# Altium project H-Watch.PrjPcb (part 1 of 2)
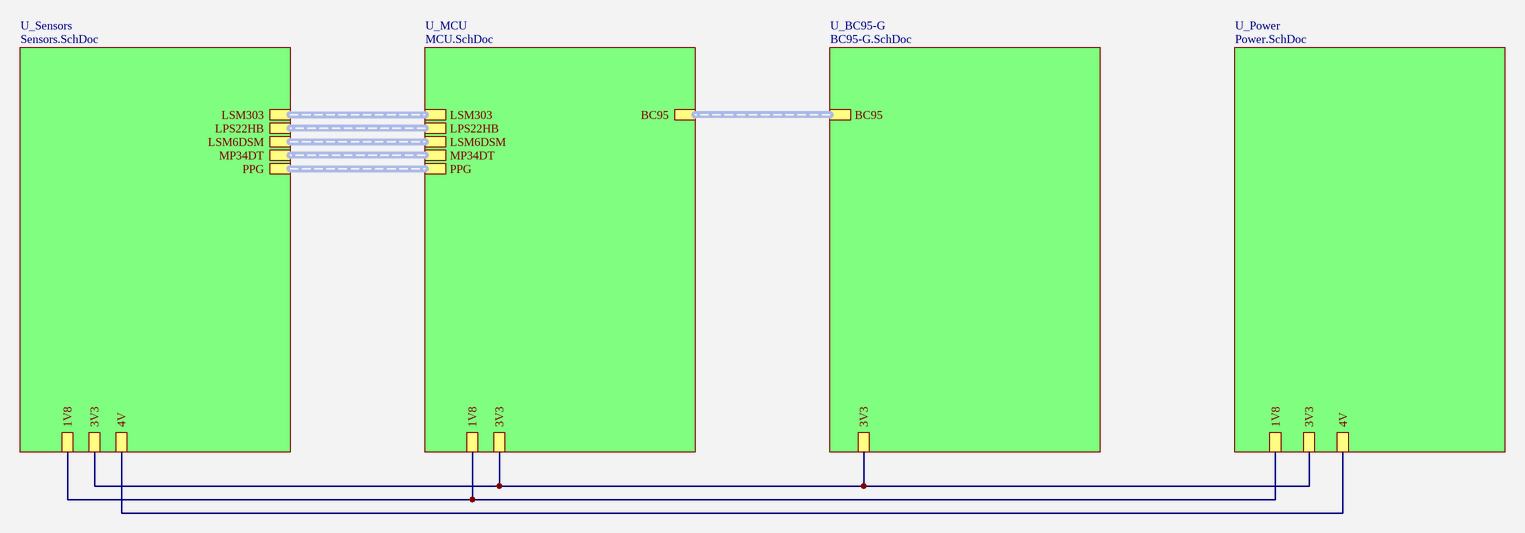
[diagram p0: H-Watch.SchDoc]
5 sheets, 122 parts. Net scope: hierarchical (ports join the sheet entries above them; power ports are global).
Board file: H-Watch.PcbDoc
Sheets:
  H-Watch.SchDoc
    U_Sensors = Sensors.SchDoc
    U_Power = Power.SchDoc
    U_MCU = MCU.SchDoc
    U_BC95-G = BC95-G.SchDoc

## Sheet H-Watch.SchDoc: H-Watch Main
size A3; DrawnBy: schuluka; Organization: ETH-PBL; DocumentNumber: SCH1V0.2; Revision: V0.2; SheetNumber: 1; SheetTotal: 5

### Sub-sheets
U_BC95-G = BC95-G.SchDoc: BC95 (harness H8), 3V3
U_MCU = MCU.SchDoc: 1V8, 3V3, LSM303 (harness *), LPS22HB (harness *), LSM6DSM (harness *), MP34DT (harness *), PPG (harness *), BC95 (harness H8)
U_Power = Power.SchDoc: 1V8, 3V3, 4V
U_Sensors = Sensors.SchDoc: PPG (harness *), MP34DT (harness *), LSM6DSM (harness *), LPS22HB (harness *), LSM303 (harness *), 1V8, 4V, 3V3

### Nets
1V8: sheet U_Sensors/1V8, sheet U_Power/1V8, sheet U_MCU/1V8
3V3: sheet U_Sensors/3V3, sheet U_Power/3V3, sheet U_MCU/3V3, sheet U_BC95-G/3V3
4V: sheet U_Sensors/4V, sheet U_Power/4V

### Buses and harness runs
harness sheet U_BC95-G/BC95 = sheet U_MCU/BC95
harness sheet U_MCU/LPS22HB = sheet U_Sensors/LPS22HB
harness sheet U_MCU/LSM6DSM = sheet U_Sensors/LSM6DSM
harness sheet U_MCU/LSM303 = sheet U_Sensors/LSM303
harness sheet U_MCU/MP34DT = sheet U_Sensors/MP34DT
harness sheet U_MCU/PPG = sheet U_Sensors/PPG

### Notes on the sheet
- 1
- 2
- 3
- 4
- 5
- 6
- 7
- 8
- A
- B
- C
- D
- Project:
- Date:
- Drawing number:
- Rev:
- Format:
- A3
- Drawn by:
- Laboratory:
- Page
- Sheet:
- of
- File:

## Sheet Sensors.SchDoc: H-Watch Sensors
size A3; DrawnBy: schuluka; Organization: ETH-PBL; DocumentNumber: SCH2V0.2; Revision: V0.2; SheetNumber: 2; SheetTotal: 5
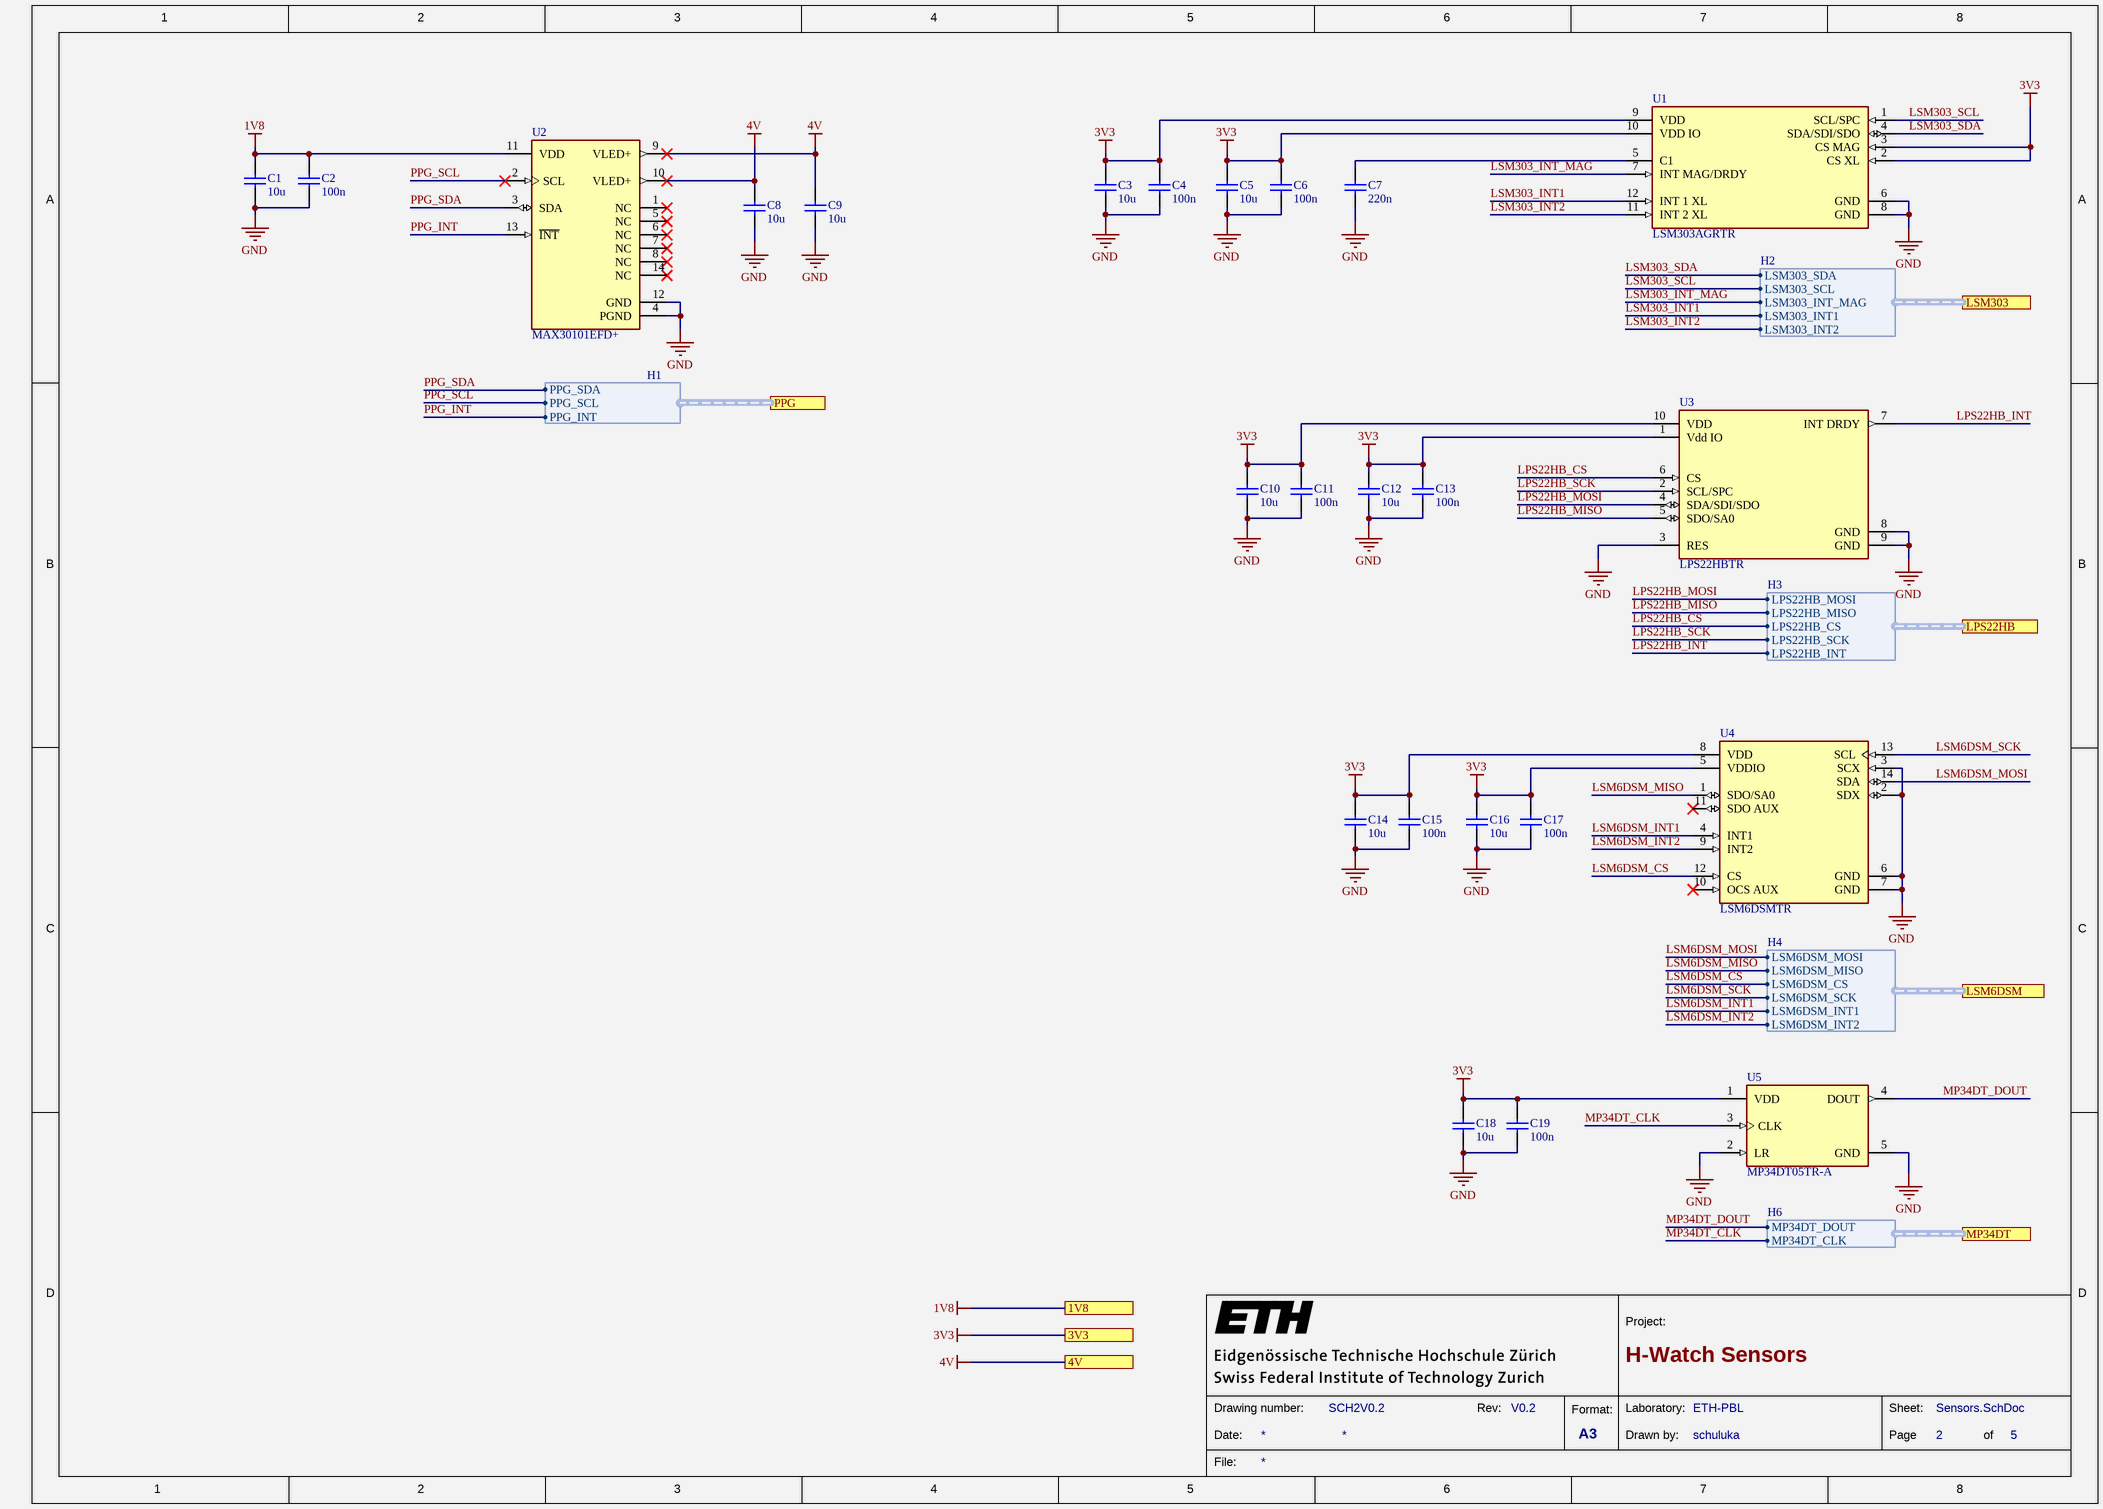
[diagram p1: Sensors.SchDoc]

### Parts
C1  10u  [CAPC1005X70X10NL05]
C2  100n  [CAPC1005X60X30ML05T10]
C3  10u  [CAPC1005X70X10NL05]
C4  100n  [CAPC1005X60X30ML05T10]
C5  10u  [CAPC1005X70X10NL05]
C6  100n  [CAPC1005X60X30ML05T10]
C7  220n  [CAPC1005X55X25ML05T10]
C8  10u  [CAPC1005X70X10NL05]
C9  10u  [CAPC1005X70X10NL05]
C10  10u  [CAPC1005X70X10NL05]
C11  100n  [CAPC1005X60X30ML05T10]
C12  10u  [CAPC1005X70X10NL05]
C13  100n  [CAPC1005X60X30ML05T10]
C14  10u  [CAPC1005X70X10NL05]
C15  100n  [CAPC1005X60X30ML05T10]
C16  10u  [CAPC1005X70X10NL05]
C17  100n  [CAPC1005X60X30ML05T10]
C18  10u  [CAPC1005X70X10NL05]
C19  100n  [CAPC1005X60X30ML05T10]
U1  LSM303AGRTR  [FP-LGA-12-8487206-MFG]
U2  MAX30101EFD+  [FP-F143A5-1-MFG]
U3  LPS22HBTR  [FP-HLGA-10L-8479831-0]
U4  LSM6DSMTR  [FP-LGA-14L-DM00249496-MFG]
U5  MP34DT05TR-A  [FP-HCLGA-DM00231908-MFG]

### Ports
1V8, 3V3, 4V, LPS22HB (harness H3), LSM6DSM (harness H4), LSM303 (harness H2), MP34DT (harness H6), PPG (harness H1)

### Harnesses
H2: LSM303_SDA, LSM303_SCL, LSM303_INT_MAG, LSM303_INT1, LSM303_INT2
H3: LPS22HB_MOSI, LPS22HB_MISO, LPS22HB_CS, LPS22HB_SCK, LPS22HB_INT
H4: LSM6DSM_MOSI, LSM6DSM_MISO, LSM6DSM_CS, LSM6DSM_SCK, LSM6DSM_INT1, LSM6DSM_INT2
H6: MP34DT_DOUT, MP34DT_CLK
H1: PPG_SDA, PPG_SCL, PPG_INT

### Nets
1V8: C1.2 C2.2 U2.11(VDD) ; port 1V8
3V3: C3.2 C4.2 C5.2 C6.2 C10.2 C11.2 C12.2 C13.2 C14.2 C15.2 C16.2 C17.2 C18.2 C19.2 U1.2(CS_XL) U1.3(CS_MAG) U1.9(VDD) U1.10(VDD_IO) U3.1(Vdd_IO) U3.10(VDD) U4.5(VDDIO) U4.8(VDD) U5.1(VDD) ; port 3V3
4V: C8.2 C9.2 U2.9(VLED+) U2.10(VLED+) ; port 4V
GND: C1.1 C2.1 C3.1 C4.1 C5.1 C6.1 C7.1 C8.1 C9.1 C10.1 C11.1 C12.1 C13.1 C14.1 C15.1 C16.1 C17.1 C18.1 C19.1 U1.6(GND) U1.8(GND) U2.4(PGND) U2.12(GND) U3.3(RES) U3.8(GND) U3.9(GND) U4.2(SDX) U4.3(SCX) U4.6(GND) U4.7(GND) U5.2(LR) U5.5(GND)
LPS22HB_CS: U3.6(CS) ; port LPS22HB.LPS22HB_CS
LPS22HB_INT: U3.7(INT_DRDY) ; port LPS22HB.LPS22HB_INT
LPS22HB_MISO: U3.5(SDO/SA0) ; port LPS22HB.LPS22HB_MISO
LPS22HB_MOSI: U3.4(SDA/SDI/SDO) ; port LPS22HB.LPS22HB_MOSI
LPS22HB_SCK: U3.2(SCL/SPC) ; port LPS22HB.LPS22HB_SCK
LSM6DSM_CS: U4.12(CS) ; port LSM6DSM.LSM6DSM_CS
LSM6DSM_INT1: U4.4(INT1) ; port LSM6DSM.LSM6DSM_INT1
LSM6DSM_INT2: U4.9(INT2) ; port LSM6DSM.LSM6DSM_INT2
LSM6DSM_MISO: U4.1(SDO/SA0) ; port LSM6DSM.LSM6DSM_MISO
LSM6DSM_MOSI: U4.14(SDA) ; port LSM6DSM.LSM6DSM_MOSI
LSM6DSM_SCK: U4.13(SCL) ; port LSM6DSM.LSM6DSM_SCK
LSM303_INT1: U1.12(INT_1_XL) ; port LSM303.LSM303_INT1
LSM303_INT2: U1.11(INT_2_XL) ; port LSM303.LSM303_INT2
LSM303_INT_MAG: U1.7(INT_MAG/DRDY) ; port LSM303.LSM303_INT_MAG
LSM303_SCL: U1.1(SCL/SPC) ; port LSM303.LSM303_SCL  [project net I2C3_SCL]
LSM303_SDA: U1.4(SDA/SDI/SDO) ; port LSM303.LSM303_SDA  [project net I2C3_SDA]
MP34DT_CLK: U5.3(CLK) ; port MP34DT.MP34DT_CLK
MP34DT_DOUT: U5.4(DOUT) ; port MP34DT.MP34DT_DOUT
PPG_INT: U2.13(~{INT}) ; port PPG.PPG_INT
PPG_SCL: U2.2(SCL) ; port PPG.PPG_SCL  [project net I2C1_SCL]
PPG_SDA: U2.3(SDA) ; port PPG.PPG_SDA  [project net I2C1_SDA]
NetC7_2: C7.2 U1.5(C1)

Not connected (* = marked no-connect by the designer): U2 1(NC)* 5(NC)* 6(NC)* 7(NC)* 8(NC)* 14(NC)*; U4 10(OCS_AUX)* 11(SDO_AUX)*

### Notes on the sheet
- 1
- 2
- 3
- 4
- 5
- 6
- 7
- 8
- A
- B
- C
- D
- Project:
- Date:
- Drawing number:
- Rev:
- Format:
- A3
- Drawn by:
- Laboratory:
- Page
- Sheet:
- of
- File:

### Library data of the parts
C1 C3 C5 C8-C10 C12 C14 C16 C18 = CMP-2000-05993-1: Chip Capacitor, 10 uF, +/- 20%, -55 to 85 degC, 0402 (1005 Metric), RoHS, Tape and Reel; PCN Part Number: MLCCPartNumberChange30/Nov/2012; Manufacturer: TDK; Voltage - Rated: 6.3V; Capacitance: 10µF; Product Training Modules: CSeriesGeneralApplicationsSEAT,CCV,andTVCLDesignToolsGuidetoReplacinganElectrolyticCapacitorwithanMLCC; Online Catalog: CSeries,GeneralPurpose; Kits: 445-9021-KIT-ND-KITMLCC100PF-10UF04026.3-50V445-9003-KIT-ND-KITCAPCERHICAPMLCCSMD; Temperature Coefficient: X5R; Other Names: 445-8920-1; Standard Package: 1; Datasheet URL: http://download.siliconexpert.com/pdfs/2015/4/21/15/54/45/779/tdk_/manual/37024850441143360mlcc_commercial_general_en.pdf; Package Description: 2-Pin Surface Mount Device, Body 1.00 x 0.50 mm; Lead Style: -; RoHS Information: RoHSCertificate-MLCC; Mounting Technology: SurfaceMount; Manufacturer URL: http://www.tdk.com/; Packaging: CutTape(CT); Series: C; Category: Capacitors; Operating Temperature: -55°C~85°C; Ratings: -; Applications: GeneralPurpose; Lead Spacing: -; Family: CeramicCapacitors; Mounting Type: SurfaceMount,MLCC; Package / Case: 0402(1005Metric); Features: -; Thickness (Max): 0.020"(0.50mm); Size / Dimension: 0.039"Lx0.020"W(1.00mmx0.50mm); Datasheet Version: 03/2015; Package Reference: 0402; Tolerance: ±20%; Height - Seated (Max): -
C2 C4 C6 C11 C13 C15 C17 C19 = CMP-2008-02046-1: Manufacturer: Kemet; Part Number: C0402C104K8PACTU
C7 = CMP-2000-05010-1: Chip Capacitor, 220 nF, +/- 10%, 16 V, -55 to 125 degC, 0402 (1005 Metric), RoHS, Tape and Reel; Manufacturer: Murata; Dielectric: C0G; Rated Voltage: 16V; Capacitance: 0.22µF; Datasheet Version: Oct-14; Tolerance (%): ±10%; Case Size/Dimension: 0402; Package Description: 2-Pin Surface Mount Device, Body 1 x 0.5 mm; Datasheet URL: https://datasheet.ciiva.com/132/product-132672.pdf; Package Reference: 402; Manufacturer URL: http://www.murata.com/
U1 = CMP-12177-000005-1: IMU ACCEL/MAG I2C/SPI 12LGA; Manufacturer: STMicroelectronics; Accel Range: 2/4/8/16g; Operating Supply Current: 3.7-200uA; Sensor Output: I2C,SPI; Accel Resolution: 16bits; Max Supply Voltage: 3.6V; Min Supply Voltage: 1.71V; Mag Sense Range: 49.152gauss (g); Sensor Type: Temperature,Accelerometer,Magnetometer; Mouser Description: IMUs - Inertial Measurement Units Ultra-compact high-performance e-compass 3D accelerometer and 3D magnetometer module; Temperature Range High: +85°C; Package: LGA-12-8487206; Manufacturer Part Number: LSM303AGRTR; Category: IC; Device Class L3: Inertial Measurement Units (IMUs); Temperature: -40°C to +85°C; Device Class L2: Motion Sensors; ComponentLink2Description: Datasheet; Octopart: https://octopart.com/lsm303agrtr-stmicroelectronics-59386630; Automotive: No; Device Class L1: Sensors; Resolution: 16bits; RoHS: TRUE; Height: 1mm; ComponentLink2URL: https://www.st.com/resource/en/datasheet/lsm303agr.pdf; Lead Free: Yes; Temperature Range Low: -40°C; Footprint Url: https://www.st.com/content/ccc/resource/technical/document/technical_note/73/17/9c/16/dd/96/4a/01/CD00134799.pdf/files/CD00134799.pdf/jcr:content/translations/en.CD00134799.pdf; Digikey Description: IMU ACCEL/MAG I2C/SPI 12LGA
U2 = CMP-05738-000001-1: INTEGRATED OPTICAL SENSOR; Manufacturer: Maxim Integrated; Max Supply Voltage: 2V; Max Junction Temp: +90°C; Operating Supply Current: 600uA; Min Supply Voltage: 1.7V; Sensor Output: I2C; RoHS: TRUE; Footprint Url: https://pdfserv.maximintegrated.com/land_patterns/90-0602.PDF; Manufacturer Part Number: MAX30101EFD+; Device Class L2: unset; Temperature Range Low: -40°C; Automotive: No; Height: 1.65mm; Temperature Range High: +85°C; ComponentLink2Description: Datasheet; Mouser Description: INTEGRATED OPTICAL SENSOR; ComponentLink2URL: https://datasheets.maximintegrated.com/en/ds/MAX30101.pdf; Octopart: https://octopart.com/max30101efd%2B-maxim+integrated-57054333; Temperature: -40°C to +85°C; Package: F143A5-1; Lead Free: Yes; Device Class L1: Sensors; Digikey Description: INTEGRATED OPTICAL SENSOR; Category: IC; Device Class L3: unset
U3 = CMP-12182-000004-1: MEMS NANO PRESSURE SENSOR: 260-1; Manufacturer: STMicroelectronics; Sensor Output: I2C,SPI; Port Style: No Port; Max Supply Voltage: 3.6V; Operating Supply Current: 3-12uA; Min Supply Voltage: 1.7V; Device Class L3: unset; Device Class L1: Sensors; Manufacturer Part Number: LPS22HBTR; Temperature Range High: +85°C; Digikey Description: MEMS NANO PRESSURE SENSOR: 260-1; Device Class L2: Pressure Sensors; RoHS: TRUE; Lead Free: Yes; Height: 0.8mm; Automotive: No; Octopart: https://octopart.com/lps22hbtr-stmicroelectronics-51851131; Package: HLGA-10L-8479831; Temperature Range Low: -40°C; Category: IC; Temperature: -40°C to +85°C; ComponentLink2Description: Datasheet; ComponentLink2URL: https://www.st.com/resource/en/datasheet/lps22hb.pdf; Footprint Url: https://www.st.com/content/ccc/resource/technical/document/technical_note/73/17/9c/16/dd/96/4a/01/CD00134799.pdf/files/CD00134799.pdf/jcr:content/translations/en.CD00134799.pdf
U4 = CMP-12177-000008-1: IMU ACCEL/GYRO I2C/SPI 14LGA; Manufacturer: STMicroelectronics; Operating Supply Current: 0.29-0.65mA; Gyro Range: 125/250/500/1000/2000°/s; Sensor Output: I2C,SPI; Accel Range: 2/4/8/16g; Min Supply Voltage: 1.62V; Resolution: 16bits; Sensor Type: Temperature,Accelerometer,Gyroscope; Max Supply Voltage: 3.6V; Manufacturer Part Number: LSM6DSMTR; Octopart: https://octopart.com/lsm6dsmtr-stmicroelectronics-66358194; Height: 0.86mm; Category: IC; Lead Free: Yes; Temperature: -40°C to +85°C; Temperature Range Low: -40°C; ComponentLink2Description: Datasheet; ComponentLink2URL: https://www.st.com/resource/en/datasheet/lsm6dsm.pdf; Digikey Description: IMU ACCEL/GYRO I2C/SPI 14LGA; Footprint Url: https://www.st.com/content/ccc/resource/technical/document/technical_note/73/17/9c/16/dd/96/4a/01/CD00134799.pdf/files/CD00134799.pdf/jcr:content/translations/en.CD00134799.pdf; Device Class L1: Sensors; Device Class L2: Motion Sensors; Temperature Range High: +85°C; Mouser Description: LSM6DSM Series 3.6 V I2C/SPI 3D Accelerometer and 3D Gyroscope - LGA-14; Device Class L3: Inertial Measurement Units (IMUs); Automotive: No; Package: LGA-14L-DM00249496; RoHS: TRUE
U5 = CMP-12231-000001-1: MEMS AUD MIC SENSOR OMNI 4HCLGA; Manufacturer: STMicroelectronics; Min Supply Voltage: 1.6V; Max Supply Voltage: 3.6V; Operating Supply Voltage: 1.8V; Frequency: 2.4MHz; Direction: Omidirectional; Current: 650uA; Lead Free: Yes; Digikey Description: MEMS AUD MIC SENSOR OMNI 4HCLGA; Device Class L1: Electromechanical; ComponentLink2Description: Datasheet; RoHS: TRUE; Temperature: -40°C to +85°C; Package: HCLGA-DM00231908; Device Class L2: Audio Products; Device Class L3: Microphones; Manufacturer Part Number: MP34DT05TR-A; Mouser Description: MP34DT05: 3.6 V MEMS Audio Sensor Omnidirectional Digital Microphone - HCLGA-4LD; Temperature Range Low: -40°C; ComponentLink2URL: https://www.st.com/resource/en/datasheet/mp34dt05-a.pdf; Octopart: https://octopart.com/mp34dt05tr-a-stmicroelectronics-87879016; Automotive: No; Height: 1.1mm; Temperature Range High: +85°C; Category: IC

## Sheet Power.SchDoc: H-Watch Power
size A3; DrawnBy: schuluka; Organization: ETH-PBL; DocumentNumber: SCH3V0.2; Revision: V0.2; SheetNumber: 3; SheetTotal: 5
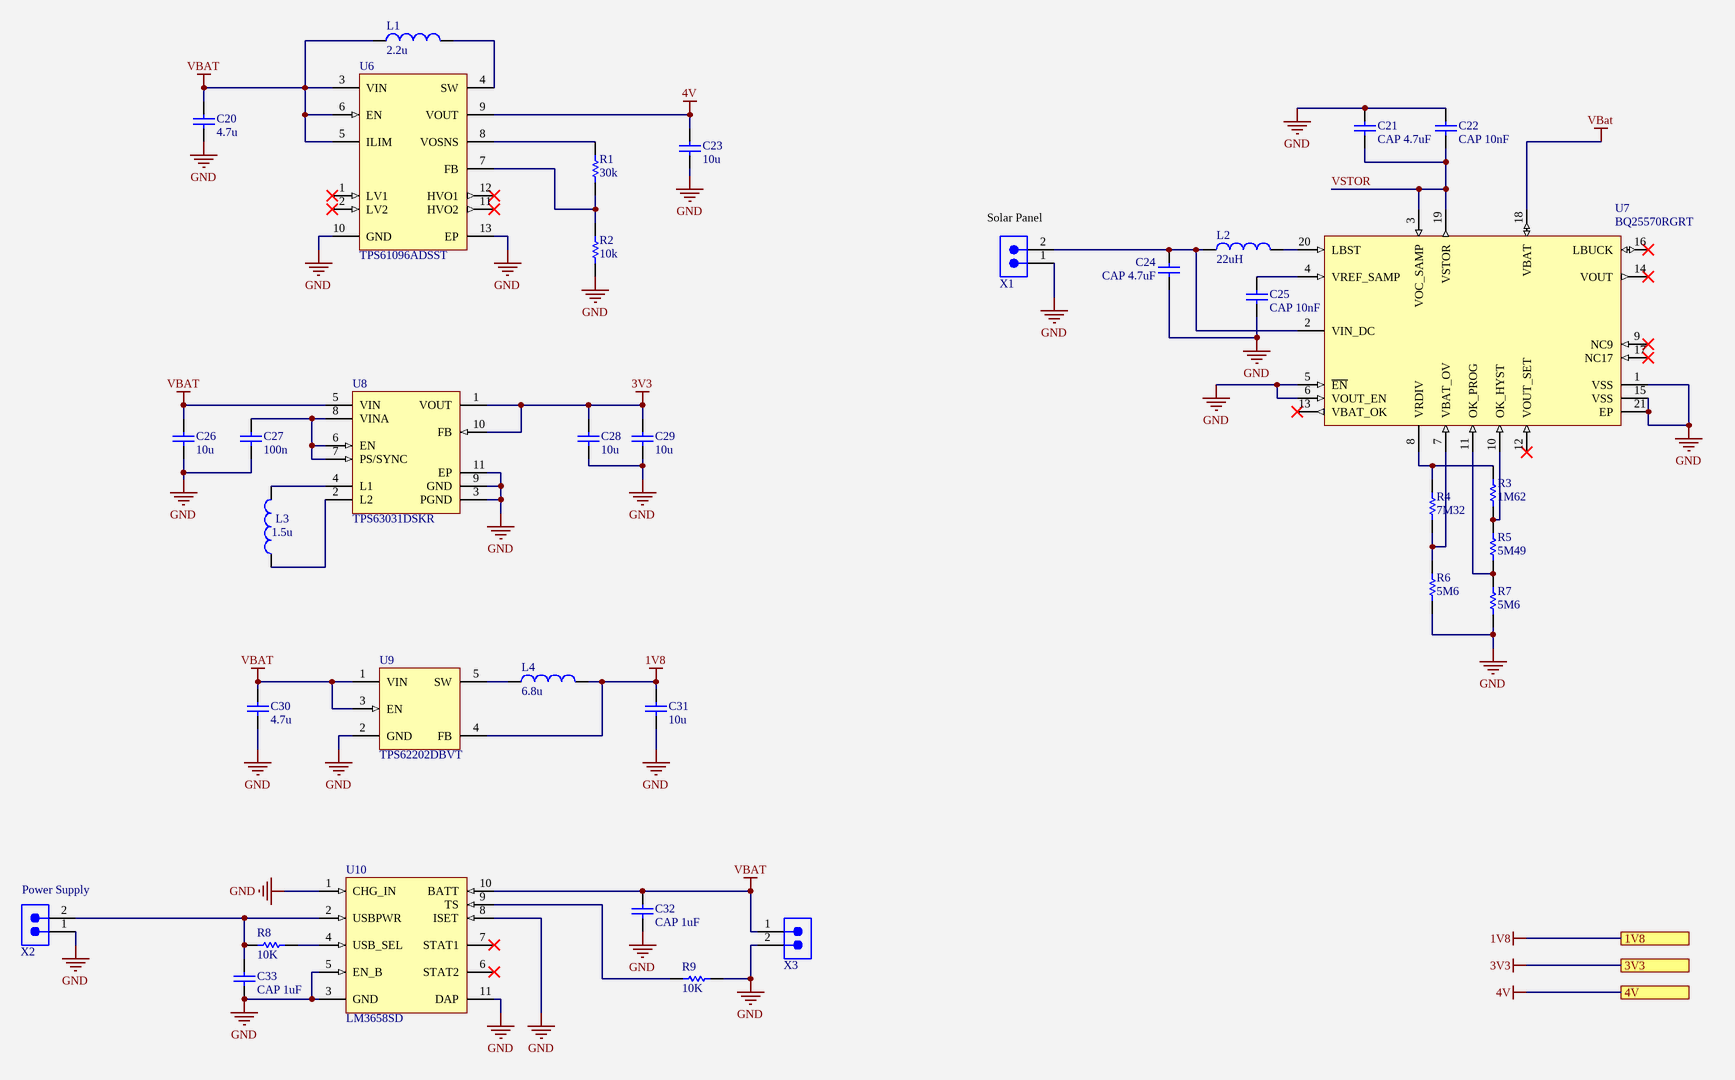
[diagram p2: Power.SchDoc]

### Parts
C20  4.7u  [CAPC1608X90X20ML10]
C21  CAP 4.7uF  [CAPC0603(1608)100_L]
C22  CAP 10nF  [CAPC0603(1608)100_L]
C23  10u  [CAPC1608X90X35NL10T15]
C24  CAP 4.7uF  [CAPC0603(1608)100_L]
C25  CAP 10nF  [CAPC0603(1608)100_L]
C26  10u  [CAPC1608X90X35NL10T15]
C27  100n  [CAPC1005X60X30ML05T10]
C28  10u  [CAPC1608X90X35NL10T15]
C29  10u  [CAPC1608X90X35NL10T15]
C30  4.7u  [CAPC1608X90X20ML10]
C31  10u  [CAPC1608X90X35NL10T15]
C32  CAP 1uF  [CAPC0603(1608)100_L]
C33  CAP 1uF  [CAPC0603(1608)100_L]
L1  2.2u  [INDC2013X140X50LL20T20]
L2  value 22uH  [INDC1210(3225)X27_L]  (hidden comment: CBC3225T220MR)
L3  1.5u  [COILCRAFT-IND-LPS3015]
L4  6.8u  [SUMI-CDRH5D28_V]
R1  30k  [RESC1005X40X25ML05T05]
R2  10k  [RESC1005X40X25LL05T05]
R3  1M62  [RESC0603(1608)_L]
R4  7M32  [RESC0603(1608)_L]
R5  5M49  [RESC0603(1608)_L]
R6  5M6  [RESC0603(1608)_L]
R7  5M6  [RESC0603(1608)_L]
R8  10K  [RESC0603(1608)_L]
R9  10K  [RESC0603(1608)_L]
U6  TPS61096ADSST  [SON50P200X80_HS-13N]
U7  BQ25570RGRT  [QFN50P350X350X100_HS-21L]
U8  TPS63031DSKR  [DSK10-2000X1200TP_V]
U9  TPS62202DBVT  [Z5+1_N]
U10  LM3658SD  [SDA10A]
X1  GRPB012VWVN-RC  [Pin Header, 1x2, TH]  (value not drawn)
X2  GRPB012VWVN-RC  [Pin Header, 1x2, TH]  (value not drawn)
X3  GRPB012VWVN-RC  [Pin Header, 1x2, TH]  (value not drawn)

### Ports
1V8, 3V3, 4V

### Nets
1V8: C31.2 L4.2 U9.4(FB) ; port 1V8
3V3: C28.2 C29.2 U8.1(VOUT) U8.10(FB) ; port 3V3
4V: C23.2 U6.9(VOUT) ; port 4V
GND: C20.1 C21.2 C22.2 C23.1 C24.1 C25.1 C26.1 C27.1 C28.1 C29.1 C30.1 C31.1 C32.1 C33.1 R2.1 R6.1 R7.1 R9.2 U6.10(GND) U6.13(EP) U7.1(VSS) U7.5(~{EN}) U7.6(VOUT_EN) U7.15(VSS) U7.21(EP) U8.3(PGND) U8.9(GND) U8.11(EP) U9.2(GND) U10.1(CHG_IN) U10.3(GND) U10.5(EN_B) U10.8(ISET) U10.11(DAP) X1.1 X2.1 X3.2
VBAT: C20.2 C26.2 C30.2 C32.2 L1.1 U6.3(VIN) U6.5(ILIM) U6.6(EN) U7.18(VBAT) U8.5(VIN) U9.1(VIN) U9.3(EN) U10.10(BATT) X3.1
VSTOR: C21.1 C22.1 U7.3(VOC_SAMP) U7.19(VSTOR)
NetC24_2: C24.2 L2.1 U7.2(VIN_DC) X1.2
NetC25_2: C25.2 U7.4(VREF_SAMP)
NetC27_2: C27.2 U8.6(EN) U8.7(PS/SYNC) U8.8(VINA)
NetC33_2: C33.2 R8.1 U10.2(USBPWR) X2.2
NetL1_2: L1.2 U6.4(SW)
NetL2_2: L2.2 U7.20(LBST)
NetL3_1: L3.1 U8.2(L2)
NetL3_2: L3.2 U8.4(L1)
NetL4_1: L4.1 U9.5(SW)
NetR1_1: R1.1 R2.2 U6.7(FB)
NetR1_2: R1.2 U6.8(VOSNS)
NetR3_1: R3.1 R5.2 U7.10(OK_HYST)
NetR3_2: R3.2 R4.2 U7.8(VRDIV)
NetR4_1: R4.1 R6.2 U7.7(VBAT_OV)
NetR5_1: R5.1 R7.2 U7.11(OK_PROG)
NetR8_2: R8.2 U10.4(USB_SEL)
NetR9_1: R9.1 U10.9(TS)

Not connected (* = marked no-connect by the designer): U6 1(LV1)* 2(LV2)* 11(HVO2)* 12(HVO1)*; U7 9(NC9)* 12(VOUT_SET)* 13(VBAT_OK)* 14(VOUT)* 16(LBUCK)* 17(NC17)*; U10 6(STAT2)* 7(STAT1)*

### Notes on the sheet
- (near X1) Solar Panel
- (near X2) Power Supply
- 1
- 2
- 3
- 4
- 5
- 6
- 7
- 8
- A
- B
- C
- D
- Project:
- Date:
- Drawing number:
- Rev:
- Format:
- A3
- Drawn by:
- Laboratory:
- Page
- Sheet:
- of
- File:

### Library data of the parts
C20 C30 = CMP-2000-04981-1: CAP, Ceramic, 4.7 uF, +/- 10%, 16 V, -55 to 85 degC, 0603 (1608 Metric), RoHS, Tape and Reel; Manufacturer: TDK; PCN Part Number: MLCCPartNumberChange30/Nov/2012; Other Names: 445-7478-1; Product Training Modules: CSeriesGeneralApplicationsSEAT,CCV,andTVCLDesignToolsGuidetoReplacinganElectrolyticCapacitorwithanMLCC; Design Resources: 20WNon-IsolatedBuckLEDDriverUsingPLLNK460KG; Online Catalog: CSeries,GeneralPurpose; Temperature Coefficient: X5R; Kits: 445-9003-KIT-ND-KITCAPCERHICAPMLCCSMD; Voltage - Rated: 16V; Capacitance: 4.7µF; Manufacturer URL: http://www.tdk.com/; Applications: GeneralPurpose; Height - Seated (Max): -; Mounting Type: SurfaceMount,MLCC; Lead Style: -; Packaging: CutTape(CT); Datasheet Version: Mar-15; Features: -; Ratings: -; Package / Case: 0603(1608Metric); Thickness (Max): 0.035"(0.90mm); Datasheet URL: http://download.siliconexpert.com/pdfs/2015/4/21/15/54/45/779/tdk_/manual/37024850441143360mlcc_commercial_general_en.pdf; Category: Capacitors; Family: CeramicCapacitors; Operating Temperature: -55degC~85degC; Size / Dimension: 0.063"Lx0.031"W(1.60mmx0.80mm); RoHS Information: RoHSCertificate-MLCC; Lead Spacing: -; Package Description: 2-Pin Surface Mount Device, Body 1.6 x 0.8 mm; Tolerance: ±10%; Series: C; Standard Package: 1; Package Reference: 603
C21 C24 = CMP-1035-02785-1: CAP 4.7uF 10V ±10% 0603 (1608 Metric) Thickness 1mm SMD; Tolerance: Â±10%; Case-EIA: 0603; Case-Metric: 1608; Max Thickness: 1 mm; Value: 4.7uF; Technology: SMT; Rated Voltage: 10 V
C22 C25 = CMP-1035-02304-1: CAP 10nF 10V ±2% 0603 (1608 Metric) Thickness 1mm SMD; Tolerance: Â±2%; Case-EIA: 0603; Case-Metric: 1608; Technology: SMT; Rated Voltage: 10 V; Value: 10nF; Max Thickness: 1 mm
C23 C26 C28 C29 C31 = CMP-2006-02792-1: Part Number: GRM188R60J106ME47D; Manufacturer: Murata
C27 = CMP-2008-02046-1: as C2 on sheet Sensors
C32 C33 = CMP-1035-02733-1: CAP 1uF 10V ±10% 0603 (1608 Metric) Thickness 1mm SMD; Tolerance: Â±10%; Case-EIA: 0603; Case-Metric: 1608; Rated Voltage: 10 V; Max Thickness: 1 mm; Value: 1uF; Technology: SMT
L1 = CMP-2000-05964-1: Wire-Wound Chip Power Inductor, 2.2 uH, +/- 20%, -40 to 105 degC, 2-Pin SMD (0805), RoHS, Tape and Reel; Manufacturer: Taiyo Yuden; Inductance: 2.2µH; Other Names: 587-2905-2 / LQBRC2012T2R2MD; Type: Wirewound; Current - Saturation: 1.1A; Online Catalog: BRSeries; EDA / CAD Models: DownloadfromAcceleratedDesigns; Shielding: Unshielded; DC Resistance (DCR): 143mOhmMax; Current Rating: 1A; Frequency - Test: 1MHz; Frequency - Self Resonant: 350MHz; Series: BR; Size / Dimension: 0.079"Lx0.049"W(2.00mmx1.25mm); Datasheet URL: http://ds.yuden.co.jp/TYCOMPAS/ut/detail.do?productNo=BRC2012T2R2MD&fileName=BRC2012T2R2MD_SS&mode=specSheetDownload; Tolerance: ±20%; Mounting Technology: SurfaceMount; Standard Package: 2,000; Category: Inductors,Coils,Chokes; Operating Temperature: -40°C~105°C; Mounting Type: SurfaceMount; Height - Seated (Max): 0.055"(1.40mm); Datasheet Version: 09/2016; Package Reference: 0805; Package Description: 2-Pin Surface Mount Device, Body 2 x 1.25 mm; Packaging: Tape&Reel(TR); Package / Case: 0805(2012Metric); Family: FixedInductors; Manufacturer URL: http://www.t-yuden.com/
L2 = CMP-01012-1: FIXED IND 22UH 780MA 351 MOHM; Core Material: Ferrite; Inductance Tolerance: 20%; Self Resonant Frequency: 17MHz; Saturation Current: 620mA; Shielding: Unshielded; DC Resistance (DCR): 351mR; Test Frequency: 100kHz; Mount: Surface Mount; Case/Package: 1210; Number of Pins: 2; Case Code (Metric): 3225; Case Code (Imperial): 1210; Min Operating Temperature: -40°C; Max Operating Temperature: 105°C; Current Rating: 780mA; Packaging: Tape and Reel; Package Quantity: 1000; Tolerance: 20%; Composition: Wirewound; Inductance: 22uh; Max DC Current: 780mA; Termination: SMD/SMT; DC Current: 780mA; Military Standard: Not; Length: 0.126inch; Height: 2.5mm; Width: 0.098inch; Height - Seated (Max): 0.106inch; Depth: 2.7mm; Radiation Hardening: No; REACH SVHC: Unknown; Lead Free: Lead Free; Halogen Free: Halogen Free
L3 = CMP-00861-1: INDUCTOR, SHLD, 1.5UH, 20%, 1.3A, SMD; Core Material: Ferrite; Saturation Current: 2.1A; DC Resistance (DCR): 100mR; Shielding: Shielded; Max DC Current: 2.2A; Self Resonant Frequency: 140MHz; Test Frequency: 100kHz; Weight: 0.001411oz; Min Operating Temperature: -40°C; Max Operating Temperature: 85°C; Inductance Tolerance: 20%; Packaging: Cut Tape; Inductance: 1.5uh; RMS Current (Irms): 1.3A; Termination: SMD/SMT; Tolerance: 20%; Package Quantity: 1; Length: 3mm; Height: 1.5mm; Width: 3mm; REACH SVHC: No SVHC
L4 = CMP-2000-06085-1: Power Inductor, 6.2 uH, +/- 30%, 1.8 A, -40 to 100 degC, 2-Pin SMD, RoHS, Tape and Reel; Manufacturer: Sumida; DC Resistance (DCR): 45mOhmMax; Frequency - Test: 100kHz; Product Training Modules: PowerInductorBasics; Other Names: 308-1542-1; Shielding: Shielded; Current Rating: 1.8A; Inductance: 6.2µH; Material - Core: Ferrite; Package Description: 2-Pin Surface Mount Device, Body 5.7 x 5.7 mm; Current - Saturation: -; Family: FixedInductors; Frequency - Self Resonant: -; Q @ Freq: -; Mounting Technology: SurfaceMount; Operating Temperature: -40°C~100°C; Package Reference: CDRH5D28; Datasheet Version: 01/2014; Tolerance: ±30%; Ratings: -; Size / Dimension: 0.224"Lx0.224"W(5.70mmx5.70mm); Category: Inductors,Coils,Chokes; Height - Seated (Max): 0.118"(3.00mm); Mounting Type: SurfaceMount; Packaging: CutTape(CT); Manufacturer URL: http://www.sumida.com/; Standard Package: 1; Datasheet URL: http://products.sumida.com/products/pdf/CDRH5D28.pdf; Package / Case: Nonstandard; Series: CDRH5D28; Type: -
R1 = CMP-2002-01142-1: Manufacturer: Panasonic; Part Number: ERJ-2RKF3002X
R2 = CMP-2000-07588-1: Chip Resistor, 10 KOhm, +/- 1%, 0.1 W, -55 to 155 degC, 0402 (1005 Metric), RoHS, Tape and Reel; Manufacturer: Panasonic; Power Rating: 100mW; Voltage Rating: 50V; Resistance: 10KOhm; Case\/Package: 0402; Temperature Coefficient: 100ppm\/degreesC; RoHSCompliant: True; Lead Free: LeadFree; Package Quantity: 1; Contact Plating: Tin; Length: 1mm; Radiation Hardening: No; REACH SVHC: NoSVHC; Max Operating Temperature: 155degC; Depth: 0.5mm; Case Code (Imperial): 0402; Military Standard: Not; Package Description: 2-Pin Surface Mount Device, Body 1 x 0.5 mm; Termination: SMD/SMT; Case Code (Metric): 1005; Height: 0.35mm; Packaging: TapeandReel; Voltage Rating (DC): 50V; Package Reference: 402; Number of Pins: 2; Tolerance: 1%; Mounting Technology: SurfaceMount; Width: 0.02inch; Mount: SurfaceMount; Datasheet URL: https://industrial.panasonic.com/cdbs/www-data/pdf/RDA0000/AOA0000C304.pdf; Composition: ThickFilm; Datasheet Version: 02/2017; Manufacturer URL: http://www.panasonic.com/; Max Power Dissipation: 100mW; Number of Terminations: 2; Min Operating Temperature: -55degC
R3 = CMP-1012-00871-1: 1M62 0.1W 1% 0603 (1608 Metric)  SMD; Case-EIA: 0603; Value: 1620000.00 Ohm; Case-Metric: 1608; Power: 0.1 W; Tolerance: 1 %; Technology: SMT
R4 = CMP-1012-00947-1: 7M32 0.1W 1% 0603 (1608 Metric)  SMD; Case-Metric: 1608; Value: 7320000.00 Ohm; Case-EIA: 0603; Technology: SMT; Power: 0.1 W; Tolerance: 1 %
R5 = CMP-1012-00933-1: 5M49 0.1W 1% 0603 (1608 Metric)  SMD; Value: 5490000.00 Ohm; Case-EIA: 0603; Case-Metric: 1608; Power: 0.1 W; Tolerance: 1 %; Technology: SMT
R6 R7 = CMP-1012-00934-1: 5M6 0.1W 1% 0603 (1608 Metric)  SMD; Case-Metric: 1608; Case-EIA: 0603; Value: 5600000.00 Ohm; Technology: SMT; Power: 0.1 W; Tolerance: 1 %
R8 R9 = CMP-1012-00623-1: 10K 0.1W 1% 0603 (1608 Metric)  SMD; Value: 10000.00 Ohm; Case-EIA: 0603; Case-Metric: 1608; Power: 0.1 W; Tolerance: 1 %; Technology: SMT
U6 = CMP-00875-1: Boost Switching Regulator IC Positive Fixed 3.3V, - 2 Output 350mA (Switch) 6-WFDFN; Manufacturer: Texas Instruments; Function: Step-Up; Output Type: Adjustable; Number of Outputs: 1; Voltage - Input (Min): 1.8V; Voltage - Input (Max): 5.5V; Voltage - Output (Min/Fixed): 4.5V; Voltage - Output (Max): 28V; Synchronous Rectifier: No; Category: Integrated Circuits (ICs); Family: PMIC - Voltage Regulators - DC DC Switching Regulators; Series: -; Packaging: Tape & Reel (TR); Part Status: Active; Output Configuration: Positive; Topology: Boost; Current - Output: 350mA (Switch); Frequency - Switching: -; Operating Temperature: -40°C ~ 150°C (TJ); Mounting Type: Surface Mount; Package / Case: 12-WFDFN Exposed Pad; Supplier Device Package: 12-WSON (3x2); Manufacturer Part Number: TPS61096ADSST; Supplier: Digikey; Supplier Part Number: 296-46930-1-ND; ComponentLink1Description: tps61096A.pdf; ComponentLink1URL: http://www.ti.com/lit/ds/symlink/tps61096a.pdf
U7 = CMP-00082-3: IC ENERGY HARV CTRLR BATT 20VQFN; Manufacturer: Texas Instruments; Current - Supply: 488nA; Voltage - Supply: 0.12 V ~ 4 V; Packaging: Tape & Reel (TR); Applications: Energy Harvesting; Operating Temperature: -40°C ~ 125°C; Mounting Type: Surface Mount; Package / Case: 20-VFQFN Exposed Pad; Supplier Device Package: 20-VQFN (3.5x3.5); P/N: BQ25570RGRT; Supplier: Digi-Key; Supplier Part Number: 296-37014-2-ND; ComponentLink1Description: bq25570.pdf; ComponentLink1URL: http://www.ti.com/lit/ds/symlink/bq25570.pdf
U8 = CMP-00866-1: Buck-Boost Switching Regulator IC Positive Fixed 3.3V 1 Output 900mA (Switch) 10-WFDFN Exposed Pad; Switching Frequency: 2.4MHz; Output Current: 800mA; Min Input Voltage: 1.8V; Number of Outputs: 1; Max Input Voltage: 5.5V; Efficiency: 96%; Synchronous Rectifier: Yes; Quiescent Current: 25uA; Mount: Surface Mount; Number of Pins: 10; Contact Plating: Gold; Min Operating Temperature: -40°C; Max Operating Temperature: 85°C; Output Voltage: 3.3V; Packaging: Tape and Reel; Package Quantity: 3000; Max Output Current: 800mA; Min Output Voltage: 3.3V; Nominal Output Voltage: 3.3V; Topology: Buck-Boost; Operating Supply Voltage: 5.5V; Radiation Hardening: No; REACH SVHC: No SVHC; Lead Free: Lead Free
U9 = CMP-00865-1: Buck Switching Regulator IC Positive Fixed 1.8V 1 Output 300mA SOT-23; Number of Outputs: 1; Frequency: 1MHz; Max Input Voltage: 6V; Min Supply Voltage: 2.5V; Efficiency: 95%; Synchronous Rectifier: Yes; Output Power: 357mW; Quiescent Current: 15uA; Mount: Surface Mount; Case/Package: SOT-23; Number of Pins: 5; Min Operating Temperature: -40°C; Max Operating Temperature: 85°C; Packaging: Tape and Reel; Output Voltage: 1.8V; Output Current: 300mA; Max Output Current: 300mA; Max Supply Voltage: 6V; Package Quantity: 1; Min Input Voltage: 2.5V; Nominal Output Voltage: 1.8V; Switching Frequency: 1MHz; Min Output Voltage: 1.8V; Max Output Voltage: 1.8V; Termination: SMD/SMT; Length: 2.9mm; Height: 1.15mm; Width: 1.6mm; Radiation Hardening: No; REACH SVHC: No SVHC; Lead Free: Lead Free
U10 = CMP-0063-00779-2: Dual Source USB/AC Li Chemistry Charger IC for Portable Applications, 10-pin LLP; Manufacturer: National Semiconductor; CompType: MiscPower; PackageTopMarking: ZXYTT*L111B; PowerWise: N; PackageReference: SDA10A; DatasheetVersion: Nov-2006; ComponentLink2Description: LM3658 Web Page; ComponentLink3URL: http://www.national.com/packaging/folders/sda10a.html; ComponentLink1Description: LM3658 Datasheet; ComponentLink2URL: http://www.national.com/pf/LM/LM3658.html; ComponentLink1URL: http://www.national.com/ds/LM/LM3658.pdf; RevisionNote: Component URLs added; PackageVersion: revA, Oct-2003; ComponentLink3Description: SDA10A Package Page; RoHS: N; PinCount: 10; PackageDescription: LLP, Plastic, Dual, 3 x 3 x 0.8mm Body, 10 Lead, 0.5mm Pitch, No Pullback
X1-X3 = CMP-00149-1: CONN HEADER 1.27mm Pitch 1x2 POS TH DL PCB AU; Manufacturer: Sullins Connector Solutions; Connector Type: Header, Unshrouded; Number of Positions: 2; Number of Positions Loaded: All; Packaging: Bulk; Contact Type: Male Pin; Pitch: -; Number of Rows: 2; Mounting Type: Through Hole; Termination: Solder; Fastening Type: -; Features: -; Contact Finish: Gold; Contact Finish Thickness: Flash; Color: -; Manufacturer Part Number: GRPB012VWVN-RC; Supplier: Digi-Key; Supplier Part Number: S9015E-01-ND; ComponentLink1Description: GRPB_%20_2VWVN-RC%2010954-C.pdf; ComponentLink1URL: http://media.digikey.com/pdf/Data%20Sheets/Sullins%20PDFs/GRPB_%20_2VWVN-RC%2010954-C.pdf

## Sheet MCU.SchDoc: H-Watch MCH
size A3; DrawnBy: schuluka; Organization: ETH-PBL; DocumentNumber: SCH4V0.2; Revision: V0.2; SheetNumber: 4; SheetTotal: 5
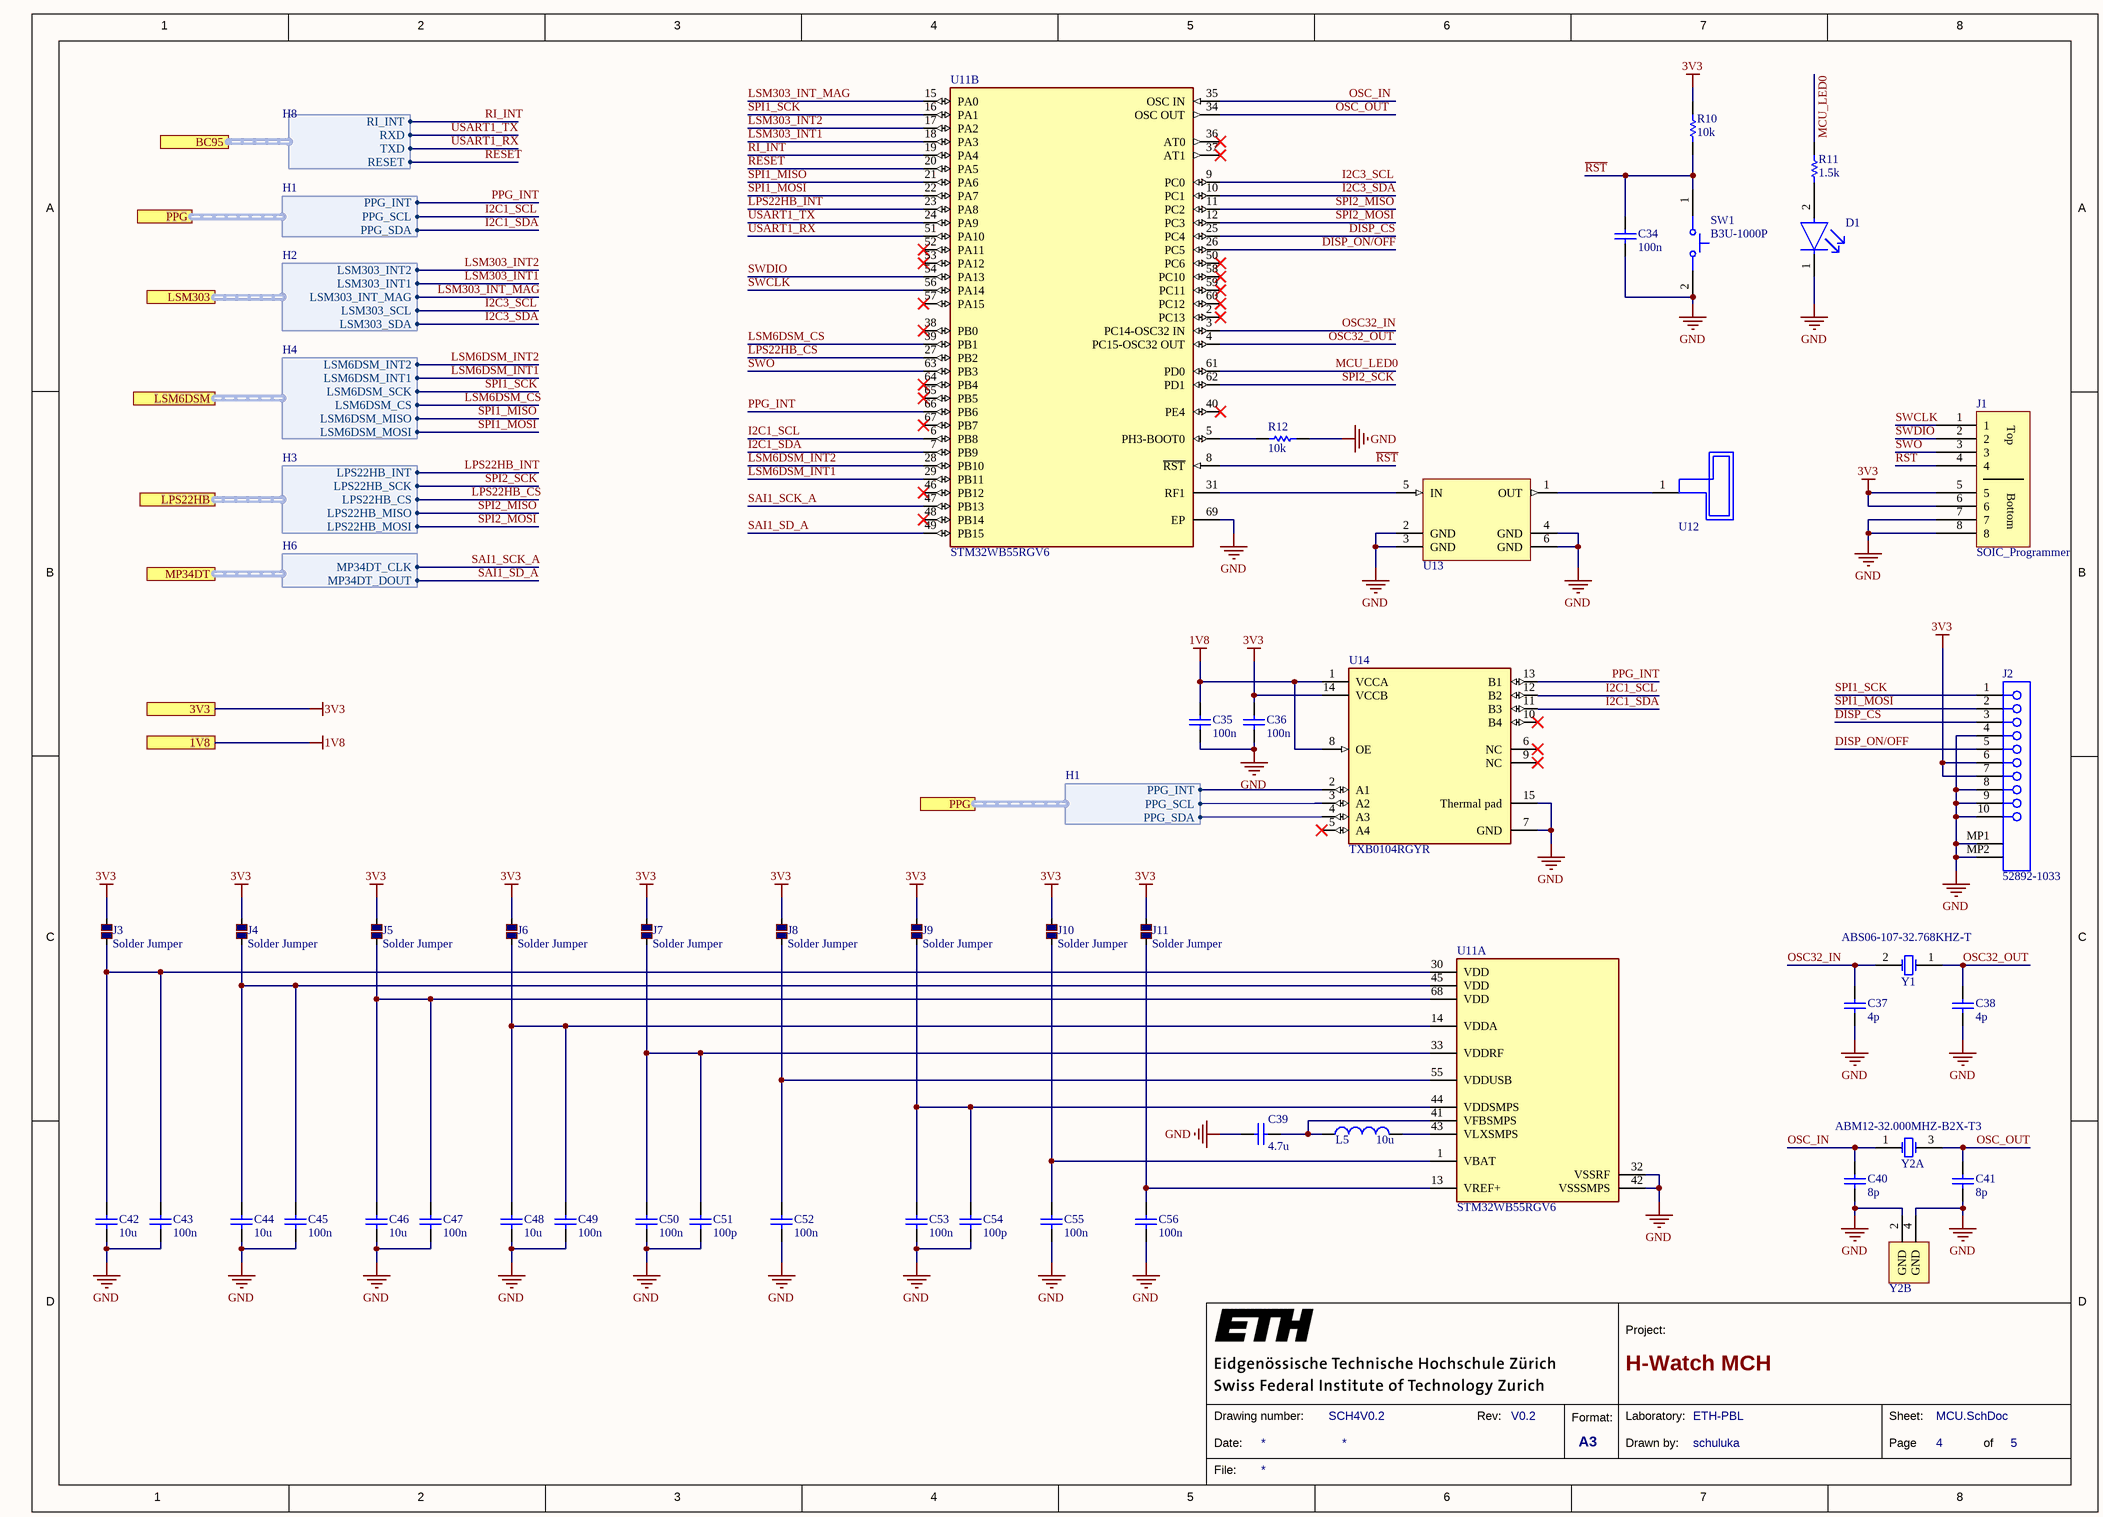
[diagram p3: MCU.SchDoc]

### Parts
C34  100n  [CAPC1005X60X30ML05T10]
C35  100n  [CAPC1005X60X30ML05T10]
C36  100n  [CAPC1005X60X30ML05T10]
C37  4p  [CAPC1005X55X25ML05T10]
C38  4p  [CAPC1005X55X25ML05T10]
C39  4.7u  [CAPC1608X90X20ML10]
C40  8p  [CAPC1005X55X25NL05T10]
C41  8p  [CAPC1005X55X25NL05T10]
C42  10u  [CAPC1005X70X10NL05]
C43  100n  [CAPC1005X60X30ML05T10]
C44  10u  [CAPC1005X70X10NL05]
C45  100n  [CAPC1005X60X30ML05T10]
C46  10u  [CAPC1005X70X10NL05]
C47  100n  [CAPC1005X60X30ML05T10]
C48  10u  [CAPC1005X70X10NL05]
C49  100n  [CAPC1005X60X30ML05T10]
C50  100n  [CAPC1005X60X30ML05T10]
C51  100p  [CAPC1005X56X25ML10T15]
C52  100n  [CAPC1005X60X30ML05T10]
C53  100n  [CAPC1005X60X30ML05T10]
C54  100p  [CAPC1005X56X25ML10T15]
C55  100n  [CAPC1005X60X30ML05T10]
C56  100n  [CAPC1005X60X30ML05T10]
D1  SML-P11VTT86R  [FP-SML-P1-MFG]  (value not drawn)
J1  SOIC_Programmer  [Programmer]
J2  52892-1033  [MOLX-52892-1033]
J3  Solder Jumper  [Small Solder Jumper]
J4  Solder Jumper  [Small Solder Jumper]
J5  Solder Jumper  [Small Solder Jumper]
J6  Solder Jumper  [Small Solder Jumper]
J7  Solder Jumper  [Small Solder Jumper]
J8  Solder Jumper  [Small Solder Jumper]
J9  Solder Jumper  [Small Solder Jumper]
J10  Solder Jumper  [Small Solder Jumper]
J11  Solder Jumper  [Small Solder Jumper]
L5  10u  [MURA-IND0805_L]
R10  10k  [RESC1005X40X25LL05T05]
R11  1.5k  [RESC1005X40X25ML05T10]
R12  10k  [RESC1005X40X25LL05T05]
SW1  B3U-1000P  [OMRON-B3U-1000_V]
U11  STM32WB55RGV6  [FP-VFQFPN-68-B029-MFG]  (parts A,B of 2)
U12  AMCA31-2R450G-S1F-T3  [AMCA31]  (value not drawn)
U13  MLPF-WB55-01E3  [MLPF-WB55-01E3]  (value not drawn)
U14  TXB0104RGYR  [FP-RGY0014A-MFG]
Y1  ABS06-107-32.768KHZ-T  [DFN140P200X60-2N-ABS06]
Y2  ABM12-32.000MHZ-B2X-T3  [ABM12]  (parts A,B of 2)

### Ports
1V8, 3V3, BC95 (harness H8), LPS22HB (harness H3), LSM6DSM (harness H4), LSM303 (harness H2), MP34DT (harness H6), PPG (harness H1)

### Harnesses
H2: LSM303_SDA, LSM303_SCL, LSM303_INT_MAG, LSM303_INT1, LSM303_INT2
H3: LPS22HB_MOSI, LPS22HB_MISO, LPS22HB_CS, LPS22HB_SCK, LPS22HB_INT
H4: LSM6DSM_MOSI, LSM6DSM_MISO, LSM6DSM_CS, LSM6DSM_SCK, LSM6DSM_INT1, LSM6DSM_INT2
H6: MP34DT_DOUT, MP34DT_CLK
H1: PPG_SDA, PPG_SCL, PPG_INT
H8: RESET, TXD, RXD, RI_INT

### Nets
1V8: C35.2 U14.1(VCCA) U14.8(OE) ; port 1V8
3V3: C36.2 J1.5 J1.6 J2.6 J2.7 J3.2 J4.2 J5.2 J6.2 J7.2 J8.2 J9.2 J10.2 J11.2 R10.2 U14.14(VCCB) ; port 3V3
GND: C34.1 C35.1 C36.1 C37.1 C38.2 C39.1 C40.1 C41.1 C42.1 C43.1 C44.1 C45.1 C46.1 C47.1 C48.1 C49.1 C50.1 C51.1 C52.1 C53.1 C54.1 C55.1 C56.1 D1.1(C) J1.7 J1.8 J2.4 J2.8 J2.9 J2.10 J2.MP1 J2.MP2 R12.1 SW1.2 U11.32(VSSRF) U11.42(VSSSMPS) U11.69(EP) U13.2(GND) U13.3(GND) U13.4(GND) U13.6(GND) U14.7(GND) U14.15(Thermal_pad) Y2.2(GND) Y2.4(GND)
DISP_CS: J2.3 U11.25(PC4)
DISP_ON/OFF: J2.5 U11.26(PC5)
I2C1_SCL: U11.6(PB8) U14.3(A2) ; port PPG.PPG_SCL
I2C1_SDA: U11.7(PB9) U14.4(A3) ; port PPG.PPG_SDA
I2C3_SCL: U11.9(PC0) ; port LSM303.LSM303_SCL
I2C3_SDA: U11.10(PC1) ; port LSM303.LSM303_SDA
LPS22HB_CS: U11.27(PB2) ; port LPS22HB.LPS22HB_CS
LPS22HB_INT: U11.23(PA8) ; port LPS22HB.LPS22HB_INT
LSM6DSM_CS: U11.39(PB1) ; port LSM6DSM.LSM6DSM_CS
LSM6DSM_INT1: U11.29(PB11) ; port LSM6DSM.LSM6DSM_INT1
LSM6DSM_INT2: U11.28(PB10) ; port LSM6DSM.LSM6DSM_INT2
LSM303_INT1: U11.18(PA3) ; port LSM303.LSM303_INT1
LSM303_INT2: U11.17(PA2) ; port LSM303.LSM303_INT2
LSM303_INT_MAG: U11.15(PA0) ; port LSM303.LSM303_INT_MAG
MCU_LED0: R11.2 U11.61(PD0)
OSC32_IN: C37.2 U11.3(PC14-OSC32_IN) Y1.2(X2)
OSC32_OUT: C38.1 U11.4(PC15-OSC32_OUT) Y1.1(X1)
OSC_IN: C40.2 U11.35(OSC_IN) Y2.1(X1)
OSC_OUT: C41.2 U11.34(OSC_OUT) Y2.3(X2)
PPG_INT: U11.66(PB6) U14.2(A1) U14.13(B1) ; port PPG.PPG_INT
~{RST}: C34.2 J1.4 R10.1 SW1.1 U11.8(~{RST})
RESET: U11.20(PA5) ; port BC95.RESET
RI_INT: U11.19(PA4) ; port BC95.RI_INT
SAI1_SCK_A: U11.47(PB13) ; port MP34DT.MP34DT_CLK  [project net MP34DT_CLK]
SAI1_SD_A: U11.49(PB15) ; port MP34DT.MP34DT_DOUT  [project net MP34DT_DOUT]
SPI1_MISO: U11.21(PA6) ; port LSM6DSM.LSM6DSM_MISO  [project net LSM6DSM_MISO]
SPI1_MOSI: J2.2 U11.22(PA7) ; port LSM6DSM.LSM6DSM_MOSI  [project net LSM6DSM_MOSI]
SPI1_SCK: J2.1 U11.16(PA1) ; port LSM6DSM.LSM6DSM_SCK  [project net LSM6DSM_SCK]
SPI2_MISO: U11.11(PC2) ; port LPS22HB.LPS22HB_MISO  [project net LPS22HB_MISO]
SPI2_MOSI: U11.12(PC3) ; port LPS22HB.LPS22HB_MOSI  [project net LPS22HB_MOSI]
SPI2_SCK: U11.62(PD1) ; port LPS22HB.LPS22HB_SCK  [project net LPS22HB_SCK]
SWCLK: J1.1 U11.56(PA14)
SWDIO: J1.2 U11.54(PA13)
SWO: J1.3 U11.63(PB3)
USART1_RX: U11.51(PA10) ; port BC95.TXD  [project net TXD]
USART1_TX: U11.24(PA9) ; port BC95.RXD  [project net RXD]
NetC39_2: C39.2 L5.1 U11.41(VFBSMPS)
NetC42_2: C42.2 C43.2 J3.1 U11.30(VDD)
NetC44_2: C44.2 C45.2 J4.1 U11.45(VDD)
NetC46_2: C46.2 C47.2 J5.1 U11.68(VDD)
NetC48_2: C48.2 C49.2 J6.1 U11.14(VDDA)
NetC50_2: C50.2 C51.2 J7.1 U11.33(VDDRF)
NetC52_2: C52.2 J8.1 U11.55(VDDUSB)
NetC53_2: C53.2 C54.2 J9.1 U11.44(VDDSMPS)
NetC55_2: C55.2 J10.1 U11.1(VBAT)
NetC56_2: C56.2 J11.1 U11.13(VREF+)
NetD1_2: D1.2(A) R11.1
NetL5_2: L5.2 U11.43(VLXSMPS)
NetR12_2: R12.2 U11.5(PH3-BOOT0)
NetU11_31: U11.31(RF1) U13.5(IN)
NetU12_1: U12.1 U13.1(OUT)

Not connected (* = marked no-connect by the designer): U11 2(PC13)* 36(AT0)* 37(AT1)* 38(PB0)* 40(PE4)* 46(PB12)* 48(PB14)* 50(PC6)* 52(PA11)* 53(PA12)* 57(PA15)* 58(PC10)* 59(PC11)* 60(PC12)* 64(PB4)* 65(PB5)* 67(PB7)*; U14 5(A4)* 6(NC)* 9(NC)* 10(B4)* 11(B3) 12(B2)

### Notes on the sheet
- 1
- 2
- 3
- 4
- 5
- 6
- 7
- 8
- A
- B
- C
- D
- Project:
- Date:
- Drawing number:
- Rev:
- Format:
- A3
- Drawn by:
- Laboratory:
- Page
- Sheet:
- of
- File:
- (in symbol SOIC_Programmer) Top; Bottom

### Library data of the parts
C34-C36 C43 C45 C47 C49 C50 C52 C53 C55 C56 = CMP-2008-02046-1: as C2 on sheet Sensors
C37 C38 = CMP-2008-03855-1: Manufacturer: Murata; Part Number: GJM1555C1H4R0CB01D
C39 = CMP-2000-04981-1: as C20 on sheet Power; Manufacturer URL: http://www.tdk.com/; Applications: GeneralPurpose; Height - Seated (Max): -; Mounting Type: SurfaceMount,MLCC; Lead Style: -; Packaging: CutTape(CT); Datasheet Version: Mar-15; Features: -; Ratings: -; Package / Case: 0603(1608Metric); Thickness (Max): 0.035"(0.90mm); Datasheet URL: http://download.siliconexpert.com/pdfs/2015/4/21/15/54/45/779/tdk_/manual/37024850441143360mlcc_commercial_general_en.pdf; Category: Capacitors; Family: CeramicCapacitors; Operating Temperature: -55degC~85degC; Size / Dimension: 0.063"Lx0.031"W(1.60mmx0.80mm); RoHS Information: RoHSCertificate-MLCC; Lead Spacing: -; Package Description: 2-Pin Surface Mount Device, Body 1.6 x 0.8 mm; Tolerance: ±10%; Series: C; Standard Package: 1; Package Reference: 603
C40 C41 = CMP-2008-03759-1: Manufacturer: Murata; Part Number: GJM1555C1H8R0CB01D
C42 C44 C46 C48 = CMP-2000-05993-1: as C1 on sheet Sensors; Standard Package: 1; Datasheet URL: http://download.siliconexpert.com/pdfs/2015/4/21/15/54/45/779/tdk_/manual/37024850441143360mlcc_commercial_general_en.pdf; Package Description: 2-Pin Surface Mount Device, Body 1.00 x 0.50 mm; Lead Style: -; RoHS Information: RoHSCertificate-MLCC; Mounting Technology: SurfaceMount; Manufacturer URL: http://www.tdk.com/; Packaging: CutTape(CT); Series: C; Category: Capacitors; Operating Temperature: -55°C~85°C; Ratings: -; Applications: GeneralPurpose; Lead Spacing: -; Family: CeramicCapacitors; Mounting Type: SurfaceMount,MLCC; Package / Case: 0402(1005Metric); Features: -; Thickness (Max): 0.020"(0.50mm); Size / Dimension: 0.039"Lx0.020"W(1.00mmx0.50mm); Datasheet Version: 03/2015; Package Reference: 0402; Tolerance: ±20%; Height - Seated (Max): -
C51 C54 = CMP-2008-02567-1: Part Number: 04025A101FAT2A.; Manufacturer: AVX Interconnect / Elco
D1 = CMP-08952-000003-1: LED RED CLEAR 1006 SMD; Manufacturer: Rohm; Led Orientation: Top View; Power Dissipation: 50mW; Wavelength: 626nm; Forward Voltage: 1.8V; Forward Current: 1mA; Luminous Intensity: 4mcd; Reverse Voltage: 5V; ComponentLink2URL: https://www.rohm.com/datasheet/SML-P11VT(R)/sml-p11-e; Temperature: -40°C to +85°C; Device Class L2: LEDs; Package: SML-P1; Category: Diode; Automotive: No; RoHS: TRUE; Lead Free: Yes; Digikey Description: LED RED CLEAR 1006 SMD; Manufacturer Part Number: SML-P11VTT86R; Device Class L3: unset; ComponentLink2Description: Datasheet; Octopart: https://octopart.com/sml-p11vtt86r-rohm-34112314; Device Class L1: Optoelectronics; Temperature Range High: +85°C; Temperature Range Low: -40°C; Mouser Description: SML-P11 Series Red 0402 Clear 4 mcd 1.8 V Surface Mount PICOLED? LED; Height: 0.25mm; Colour: Red
J2 = CMP-1241-00463-1: 0.5 mm Pitch Easy-On(TM) Type FPC Connector, 2.0 mm Mated Height, Right Angle, ZIF, SMT, Bottom Contact, 10 Circuits, -40 to 85 degC, ELV and RoHS Compliant, Tape and Reel; Manufacturer: Molex; Stackable: No; Material - Plating Termination: Silver, Tin-Bismuth; PCB Retention: Yes; Material - Metal: Phosphor Bronze; Mated Height: 2.00mm; Voltage (Max): 50V; Current (Max per Contact): 0.5A; Circuits (Loaded): 10; Durability (mating cycles max): 20; Pitch - Mating Interface: 0.50mm; Entry Angle: 90degrees Angle; PCB Locator: No; ComponentLink1Description: Manufacturer URL; PartNumber: 52892-1033; ComponentLink2URL: http://www.molex.com/webdocs/datasheets/pdf/en-us/0528921033_FFC_FPC_CONNECTORS.pdf; Orientation: Right Angle; Mounting Technology: Surface Mount; Material - Plating Mating: Silver, Tin-Bismuth; Contact Position: Bottom; PackageVersion: Rev. A, 05/2013; ComponentLink3Description: Package Specification; ComponentLink3URL: http://www.molex.com/pdm_docs/sd/528921033_sd.pdf; PackageDescription: 10-Lead FPC Connector, Pitch 0.5 mm; RoHS: TRUE; Polarized to PCB: No; ComponentLink1URL: http://www.molex.com/molex/index.jsp; Number of Rows: 1; ComponentLink2Description: Datasheet; Packing: Tape and Reel; PackageReference: 52892-1033; Pitch - Termination Interface: 0.50mm
J3-J11 = CMP-00005-5: Value: 1; Technology: SMT
L5 = CMP-2000-06587-1: Fixed Inductor, 10 uH, +/-20%, -55 to 125 degC, 2-Pin SMD (0805), RoHS, Tape and Reel; Manufacturer: Murata; Tolerance (%): 20%; DC Resistance: 0.6; Inductance-Nom: 10H; Rated Current-Max: 100mA; Package Reference: IND0805; Case Size/Dimension: 0805; Manufacturer URL: http://www.murata.com/; Package Description: 2-Pin Surface Mount Device, Body 2 x 1.25 mm; Datasheet URL: http://psearch.en.murata.com/inductor/product/LQM21FN100M70%23.pdf; Mounting Technology: SurfaceMount; Datasheet Version: 05/2016
R10 R12 = CMP-2000-07588-1: as R2 on sheet Power; RoHSCompliant: True; Lead Free: LeadFree; Package Quantity: 1; Contact Plating: Tin; Length: 1mm; Radiation Hardening: No; REACH SVHC: NoSVHC; Max Operating Temperature: 155degC; Depth: 0.5mm; Case Code (Imperial): 0402; Military Standard: Not; Package Description: 2-Pin Surface Mount Device, Body 1 x 0.5 mm; Termination: SMD/SMT; Case Code (Metric): 1005; Height: 0.35mm; Packaging: TapeandReel; Voltage Rating (DC): 50V; Package Reference: 402; Number of Pins: 2; Tolerance: 1%; Mounting Technology: SurfaceMount; Width: 0.02inch; Mount: SurfaceMount; Datasheet URL: https://industrial.panasonic.com/cdbs/www-data/pdf/RDA0000/AOA0000C304.pdf; Composition: ThickFilm; Datasheet Version: 02/2017; Manufacturer URL: http://www.panasonic.com/; Max Power Dissipation: 100mW; Number of Terminations: 2; Min Operating Temperature: -55degC
R11 = CMP-2002-07464-1: Manufacturer: Yageo / Phycomp; Part Number: RC0402FR-071K5L
SW1 = CMP-2100-03586-1: Ultra-Small Tactile Switch, 0.05 A, 12 V, -25 to 70 degC, 2-Pin SMD, RoHS, Tape and Reel; Manufacturer: Omron Electronic Components; Operating Force: 1.5N; Current Rating: 50mA; Voltage Rating (DC): 12V; Electrical Life: 200000Cycles; Actuator Length: 0.4mm; Insulation Resistance: 100MOhm; Switch Travel: 0.15mm; Throw Configuration: SPST; Illumination Type: Illuminated; Width: 3mm; Weight: 0.022g; Datasheet Version: 42005.0; Datasheet URL: http://www.omron.com/ecb/products/pdf/en-b3u.pdf; Height: 1.2mm; Package Quantity: 1; REACH SVHC: Unknown; Contact Current Rating: 50mA; Contact Material: Silver; Max Current Rating: 50mA; Package Reference: B3U-1000; Termination: SMD/SMT; Packaging: TapeandReel; Manufacturer URL: http://www.omron.com/; RoHSCompliant: true; Mount: SurfaceMount; Length: 4mm; Min Operating Temperature: -25degC; Depth: 2.5mm; Lead Free: LeadFree; Case/Package: SMD/SMT; Package Description: 2-Pin Surface Mount Device, Body 3 x 2.5 mm; Max Operating Temperature: 70degC; Orientation: Straight
U11 = CMP-12160-000001-1: ULTRA-LOW-POWER DUAL CORE ARM CO; Manufacturer: STMicroelectronics; Max Junction Temp: +125°C; Bandwidth: 75MHz; Max Frequency: 2480MHz; Sensitivity: -96dBm; Number Of Adc Channels: 19; Receiving Current: 4.5-7.9mA; Interface: I2C,SPI,UART,USART,USB; Data Rate: 2Mbits/s; Number Of Gpio: 49; Min Supply Voltage: 1.71V; Max Power Dissipation: 425mW; Max Supply Voltage: 3.6V; Standoff Height: 0mm; Octopart: https://octopart.com/stm32wb55rgv6-stmicroelectronics-98750848; Category: IC; Digikey Description: ULTRA-LOW-POWER DUAL CORE ARM CO; Height: 1mm; Device Class L2: RF Semiconductors and Devices; Automotive: No; Ambient Temperature Range High: +105°C; ComponentLink2Description: Datasheet; Ambient Temperature Range Low: -40°C; Lead Free: Yes; Temperature Range Low: -40°C; Ipc Land Pattern Name: QFN40P800X800X90-68; Device Class L1: Integrated Circuits (ICs); Manufacturer Part Number: STM32WB55RGV6; Package: VFQFPN-68-B029; RoHS: TRUE; Temperature Range High: +125°C; ComponentLink2URL: https://www.st.com/resource/en/datasheet/stm32wb55rg.pdf; Temperature: -40°C to +125°C; Device Class L3: Transceivers; Mouser Description: MCU 32-Bit STM32WB55 ARM Cortex M4 RISC 1MB Flash 1.7V to 3.6V 68-Pin VFQFPN Tray
U12 = CMP-00950-1: Antennas 2.45GHz BW 90dB + Gain -1 dBi avg.; Impedance: 50R; Bandwidth: 90MHz; Power Rating: 3W; Number of Bands: 1; Mount: Surface Mount; Case/Package: SMD/SMT; Packaging: Tape and Reel; Package Quantity: 3000; Frequency: 2.45GHz; Max Power Dissipation: 3W; Termination: Solder; Max Frequency: 2.45GHz; Height: 0.047inch
U13 = CMP-01265-1: Prices include import duty and tax. RF FILTER, 2.4GHZ TO 2.5GHZ, WLCSP-6;; Filter Type: Low Pass; Bandwidth: 100MHz; Insertion Loss: 1.1dB; Frequency: 2.45GHz Center; Ripple: -; Package / Case: 6-SMD, No Lead; Mounting Type: Surface Mount
U14 = CMP-04899-000011-1: IC TRNSLTR BIDIRECTIONAL 14VQFN; Manufacturer: Texas Instruments; Standoff Height: 0mm; V B Min: 1.65V; Data Rate: 100Mbits/s; Number Of Circuits: 1; V B Max: 5.5V; Number Of Inputs: 4; Logic Function Desc: Non-Inverting; Max Junction Temp: +150°C; V A Min: 1.2V; Nominal Supply Current: 0.06-3.5uA; V A Max: 3.6V; Propagation Delay: 4ns; Device Class L1: Integrated Circuits (ICs); ComponentLink2Description: Datasheet; Mouser Description: 4-Bit Bidirectional Voltage-Level Shifter with Auto Direction Sensing and +/-15 kV ESD Protect 14-VQFN -40 to 85; Ambient Temperature Range Low: -40°C; Temperature: -40°C to +85°C; RoHS: TRUE; Digikey Description: IC TRNSLTR BIDIRECTIONAL 14VQFN; Manufacturer Part Number: TXB0104RGYR; Lead Free: Yes; Octopart: https://octopart.com/txb0104rgyr-texas+instruments-1485948; Height: 1mm; Device Class L3: Voltage Level Shifters; Category: IC; Device Class L2: Logic ICs; Temperature Range Low: -40°C; Number Of Outputs: 4; Temperature Range High: +85°C; Package: RGY0014A; Automotive: No; Ambient Temperature Range High: +85°C; Min Supply Voltage: 1.2V; ComponentLink2URL: http://www.ti.com/lit/ds/symlink/txb0104.pdf; Max Supply Voltage: 5.5V
Y1 = CMP-00140-1: CRYSTAL 32.7680KHZ 4PF SMD; Manufacturer: Abracon LLC; Frequency Tolerance: ±20ppm; ESR (Equivalent Series Resistance): 60 kOhm; Operating Mode: Fundamental; Packaging: Cut Tape (CT); Type: kHz Crystal (Tuning Fork); Frequency: 32.768kHz; Frequency Stability: -; Load Capacitance: 4pF; Operating Temperature: -40°C ~ 85°C; Ratings: -; Mounting Type: Surface Mount; Package / Case: 0805 (2012 Metric); Size / Dimension: 0.079" L x 0.047" W (2.00mm x 1.20mm); Height: 0.024" (0.60mm); Manufacturer Part Number: ABS06-107-32.768KHZ-T; Supplier: Digi-Key; Supplier Part Number: 535-12373-1-ND; ComponentLink1Description: ABS06-107-32.768kHz-T.pdf; ComponentLink1URL: http://www.abracon.com/Resonators/ABS06-107-32.768kHz-T.pdf
Y2 = CMP-00975-1: 32MHz ±20ppm Crystal 8pF 200 Ohm -20°C ~ 70°C  Surface Mount 4-SMD, No Lead (DFN, LCC); ESR (Equivalent Series Resistance): 200R; Case/Package: CSMD; Number of Pins: 4; Min Operating Temperature: -20°C; Max Operating Temperature: 70°C; Frequency: 32MHz; Packaging: Tape and Reel; Load Capacitance: 8pF; Package Quantity: 3000; Frequency Tolerance: 20ppm; Tolerance: 20ppm; Frequency Stability: 20ppm; Termination: SMD/SMT; Composition: Ceramic; Length: 1.6mm; Height: 0.018inch; Width: 0.047inch; Depth: 1.2mm; Radiation Hardening: No; REACH SVHC: No SVHC; Lead Free: Lead Free; Mount: Surface Mount; PartId: 1